# Altium schematic sheet LD3985M33R.SchDoc
size A4; SheetNumber: 1; SheetTotal: 10
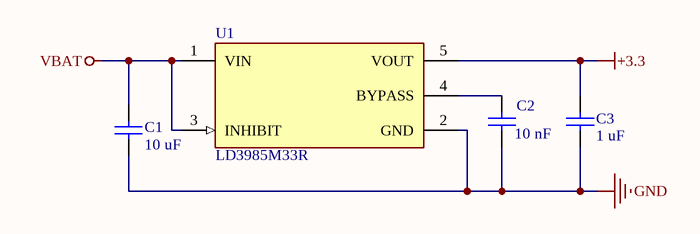
[diagram p0: LD3985M33R.SchDoc]

## Parts
C1  10 uF  [CAPC1005X55X25NL05T10]
C2  10 nF  [CAPC1005X55X25NL05T10]
C3  1 uF  [CAPC1005X55X25NL05T10]
U1  LD3985M33R  [FP-SOT23-5L-7049676-MFG]

## Nets
+3.3: C3.2 U1.5(VOUT)
GND: C1.1 C2.1 C3.1 U1.2(GND)
VBAT: C1.2 U1.1(VIN) U1.3(INHIBIT)
NetC2_2: C2.2 U1.4(BYPASS)

## Library data of the parts
C1-C3 = CMP-2008-04515-1: Manufacturer: Murata; Part Number: GRM155F50J684ZE01D
U1 = CMP-0244-00328-2: IC REG LINEAR 3.3V 150MA SOT23-5; Input Bias Current: 85uA; Output Type: Fixed; Max Input Voltage: 6V; Min Input Voltage: 2.5V; Output Voltage Accuracy: 2%; Quiescent Current: 150uA; Number of Regulators: 1; Min Current Limit: 300mA; Dropout Voltage: 60mV; Polarity: Positive; Min Operating Temperature: -40°C; Height: 1.3mm; Radiation Hardening: No; Package Quantity: 1; Number of Pins: 5; Output Current: 150mA; Width: 1.75mm; Length: 3mm; Mount: Surface Mount; Case/Package: SOT-23; Lead Free: Lead Free; Number of Outputs: 1; Max Operating Temperature: 125°C; Accuracy: 2%; Max Output Current: 150mA; Packaging: Tape and Reel; Output Voltage: 3.3V; Min Output Voltage: 3.3V